# EasyEDA Pro project 16F.eprj

# Schematic DAQ_SCH

## Sheets
1 MCU: Board Name: DAQ_MB; Create Date: 2025-05-04; Page Name: MCU; Project Name: 16F; Schematic Name: DAQ_SCH; Update Date: 2025-05-22; Company: 嘉立创EDA; Page Size: A4; Version: V1.0
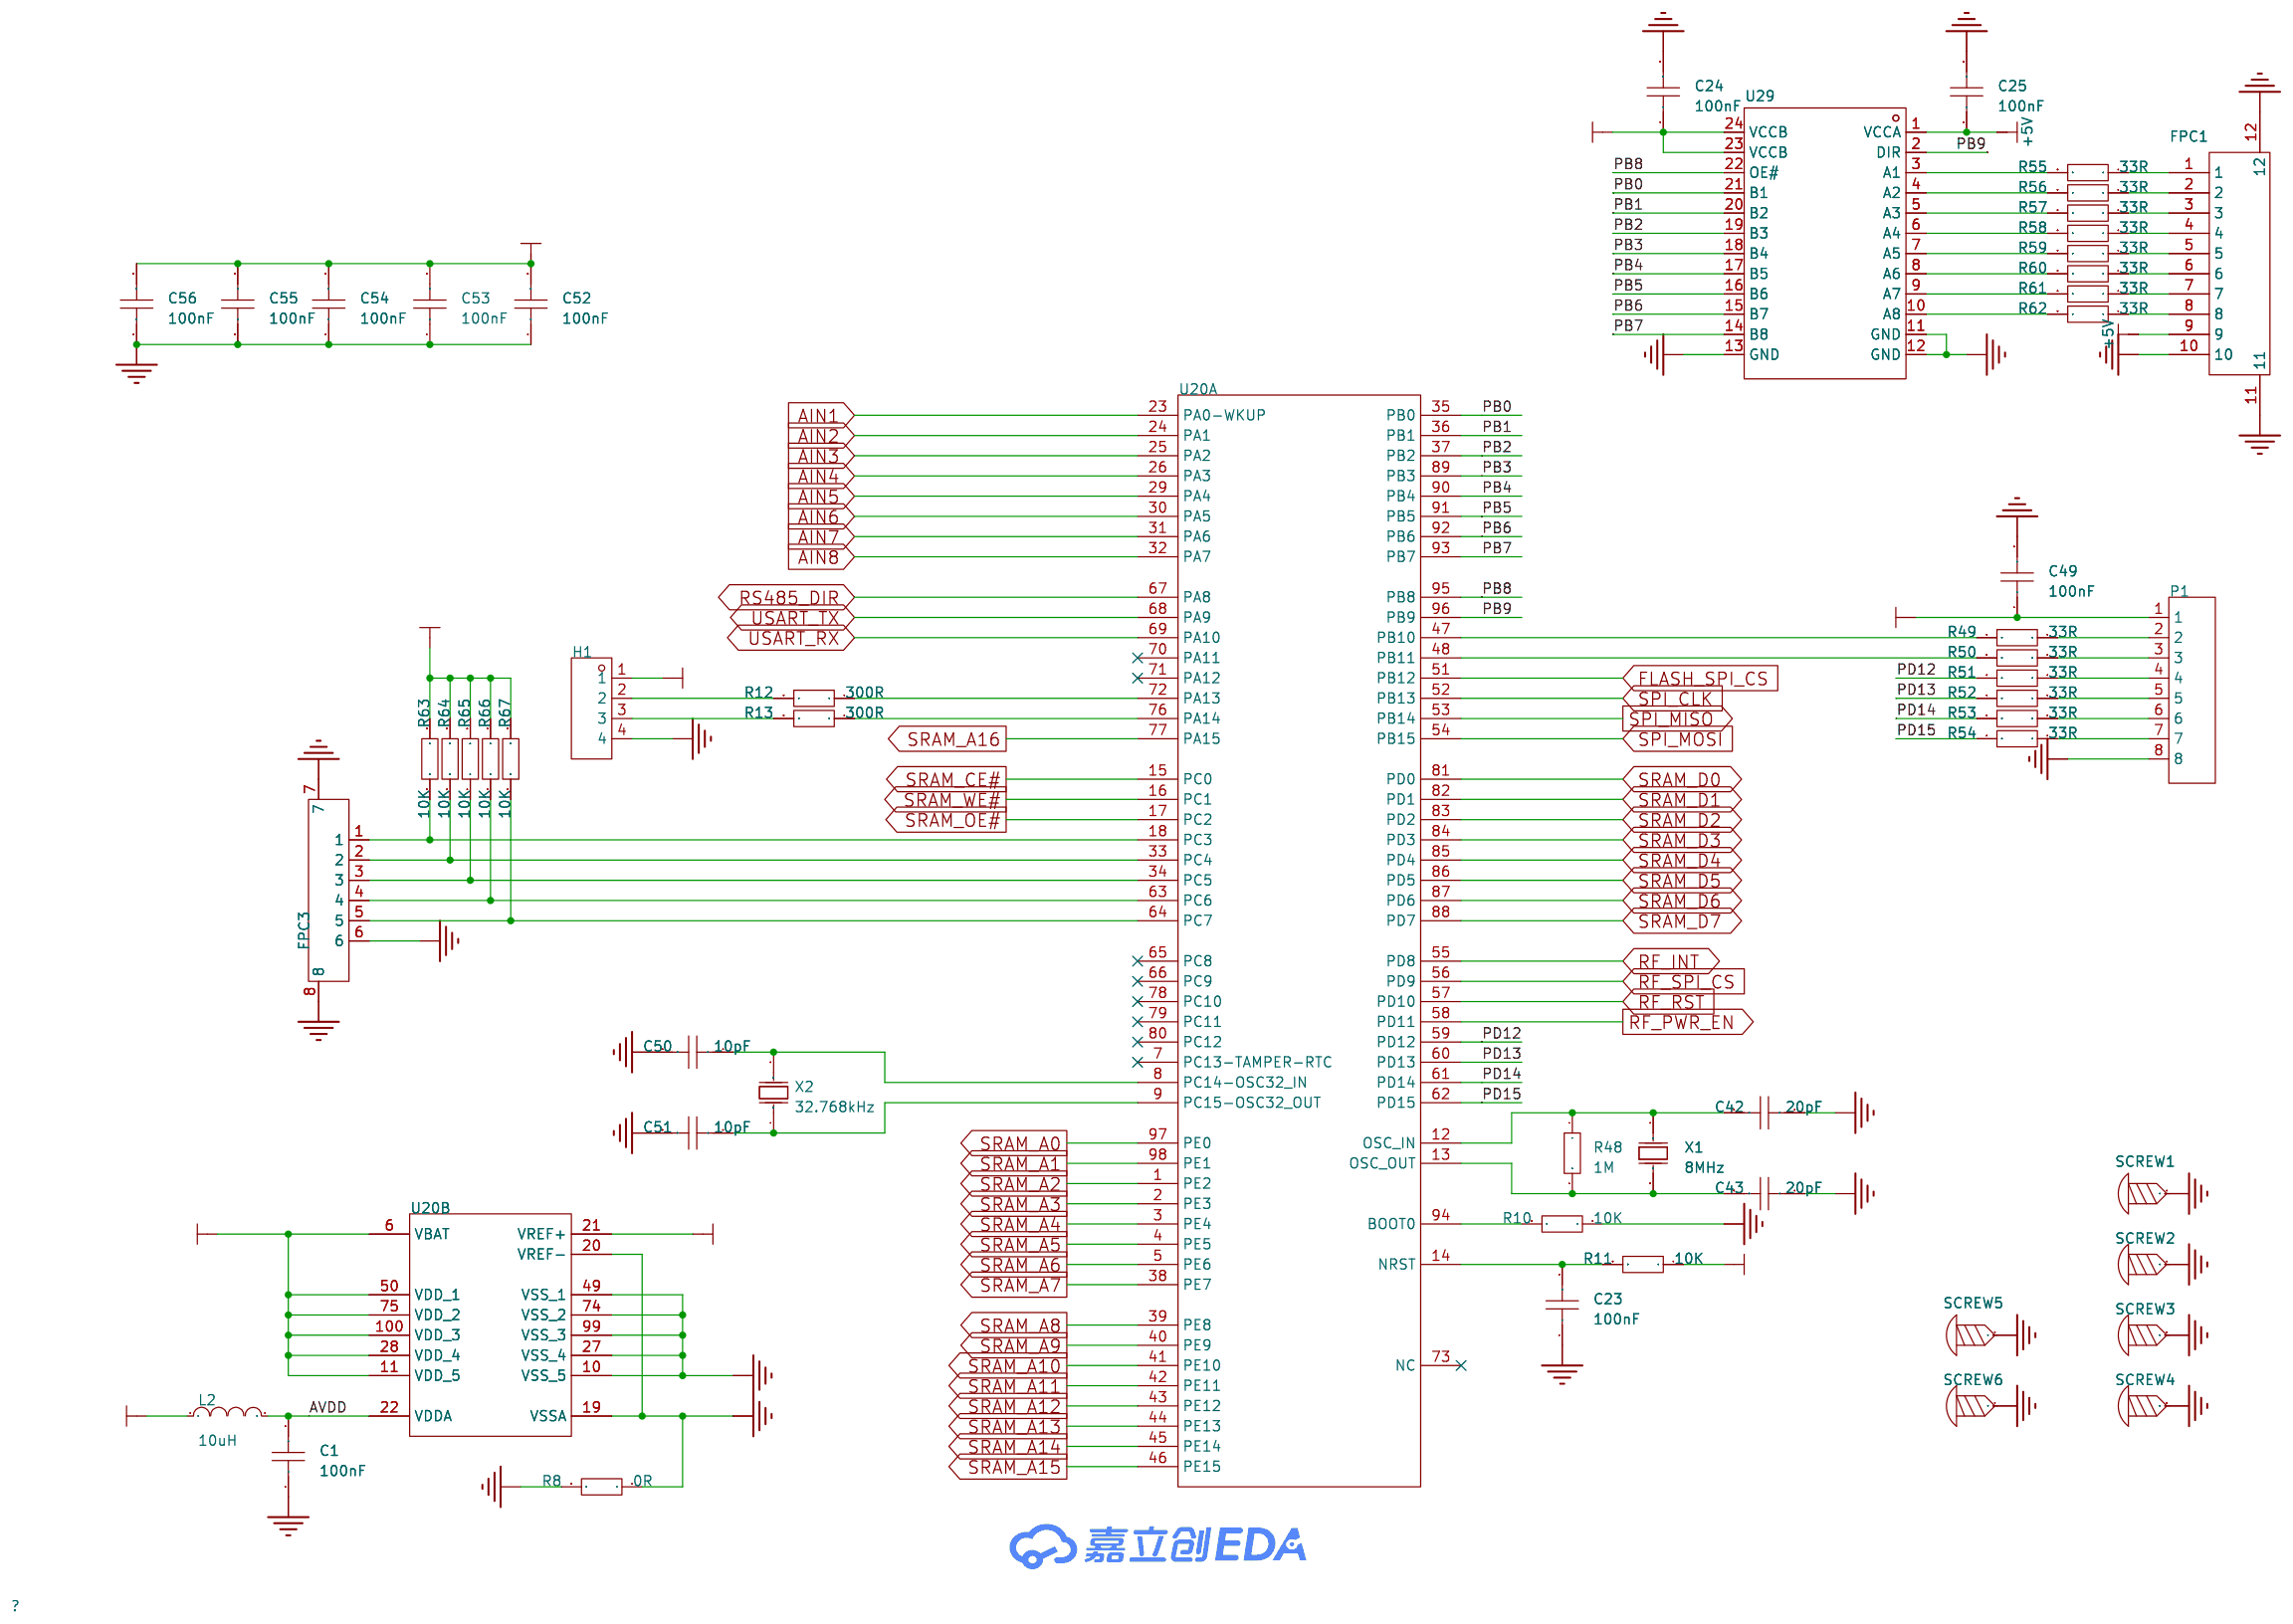
[diagram p0: MCU]
2 MEM: Page Name: MEM; Update Date: 2025-05-16
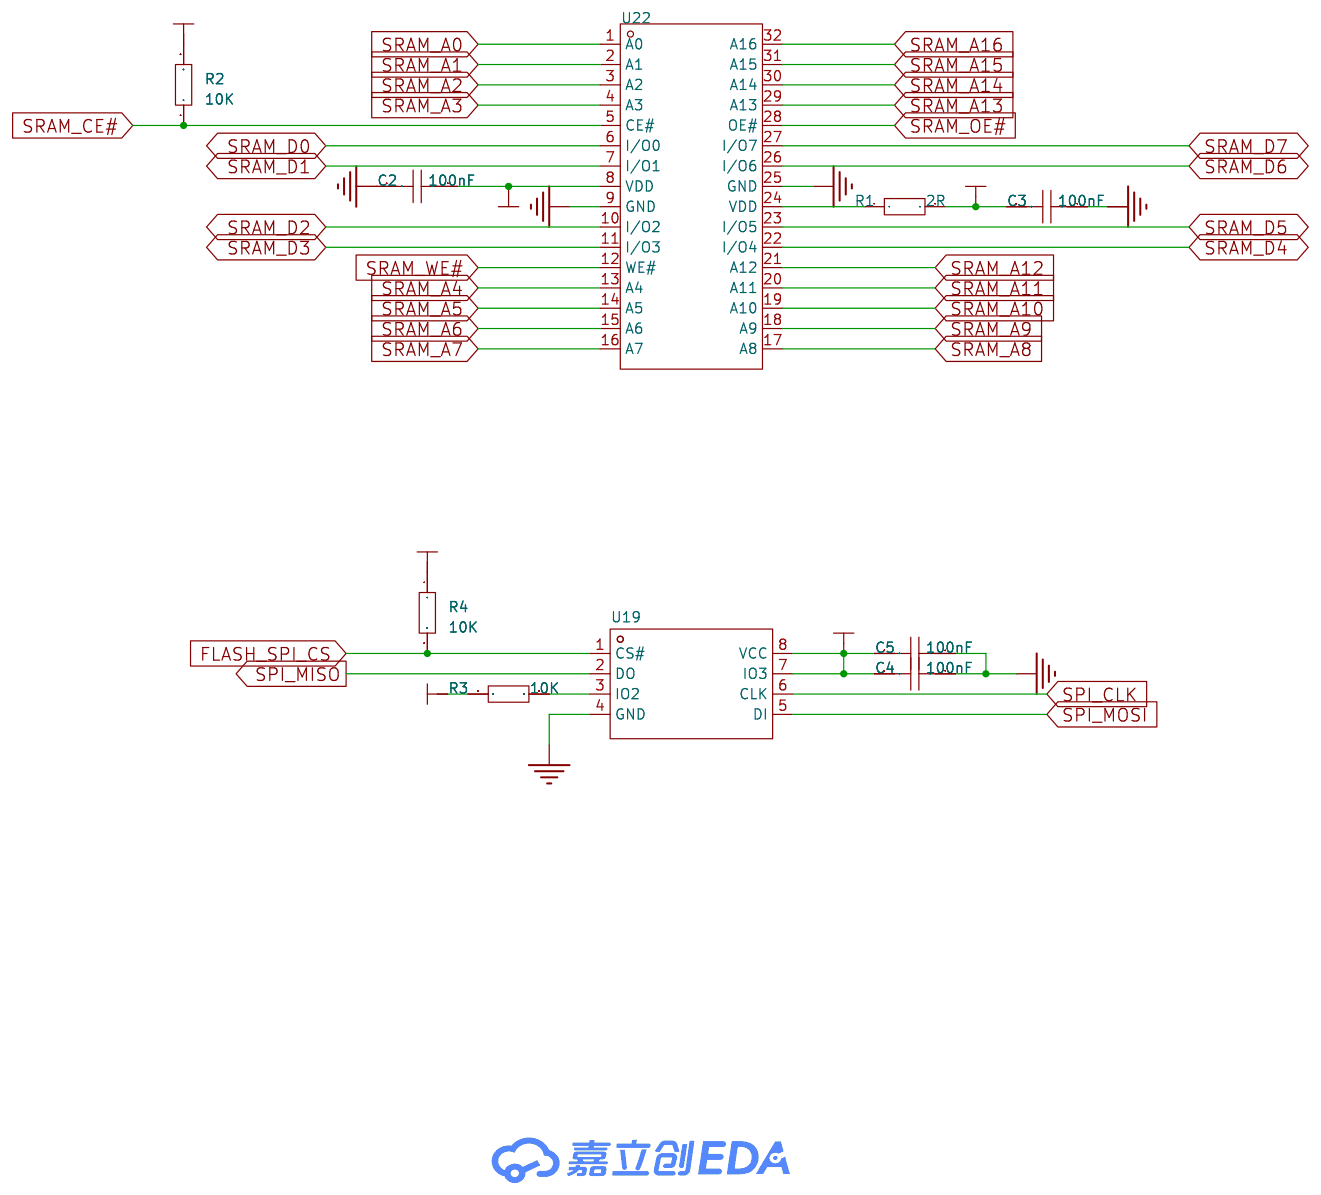
[diagram p1: MEM]
3 AIN: Page Name: AIN; Update Date: 2025-05-16
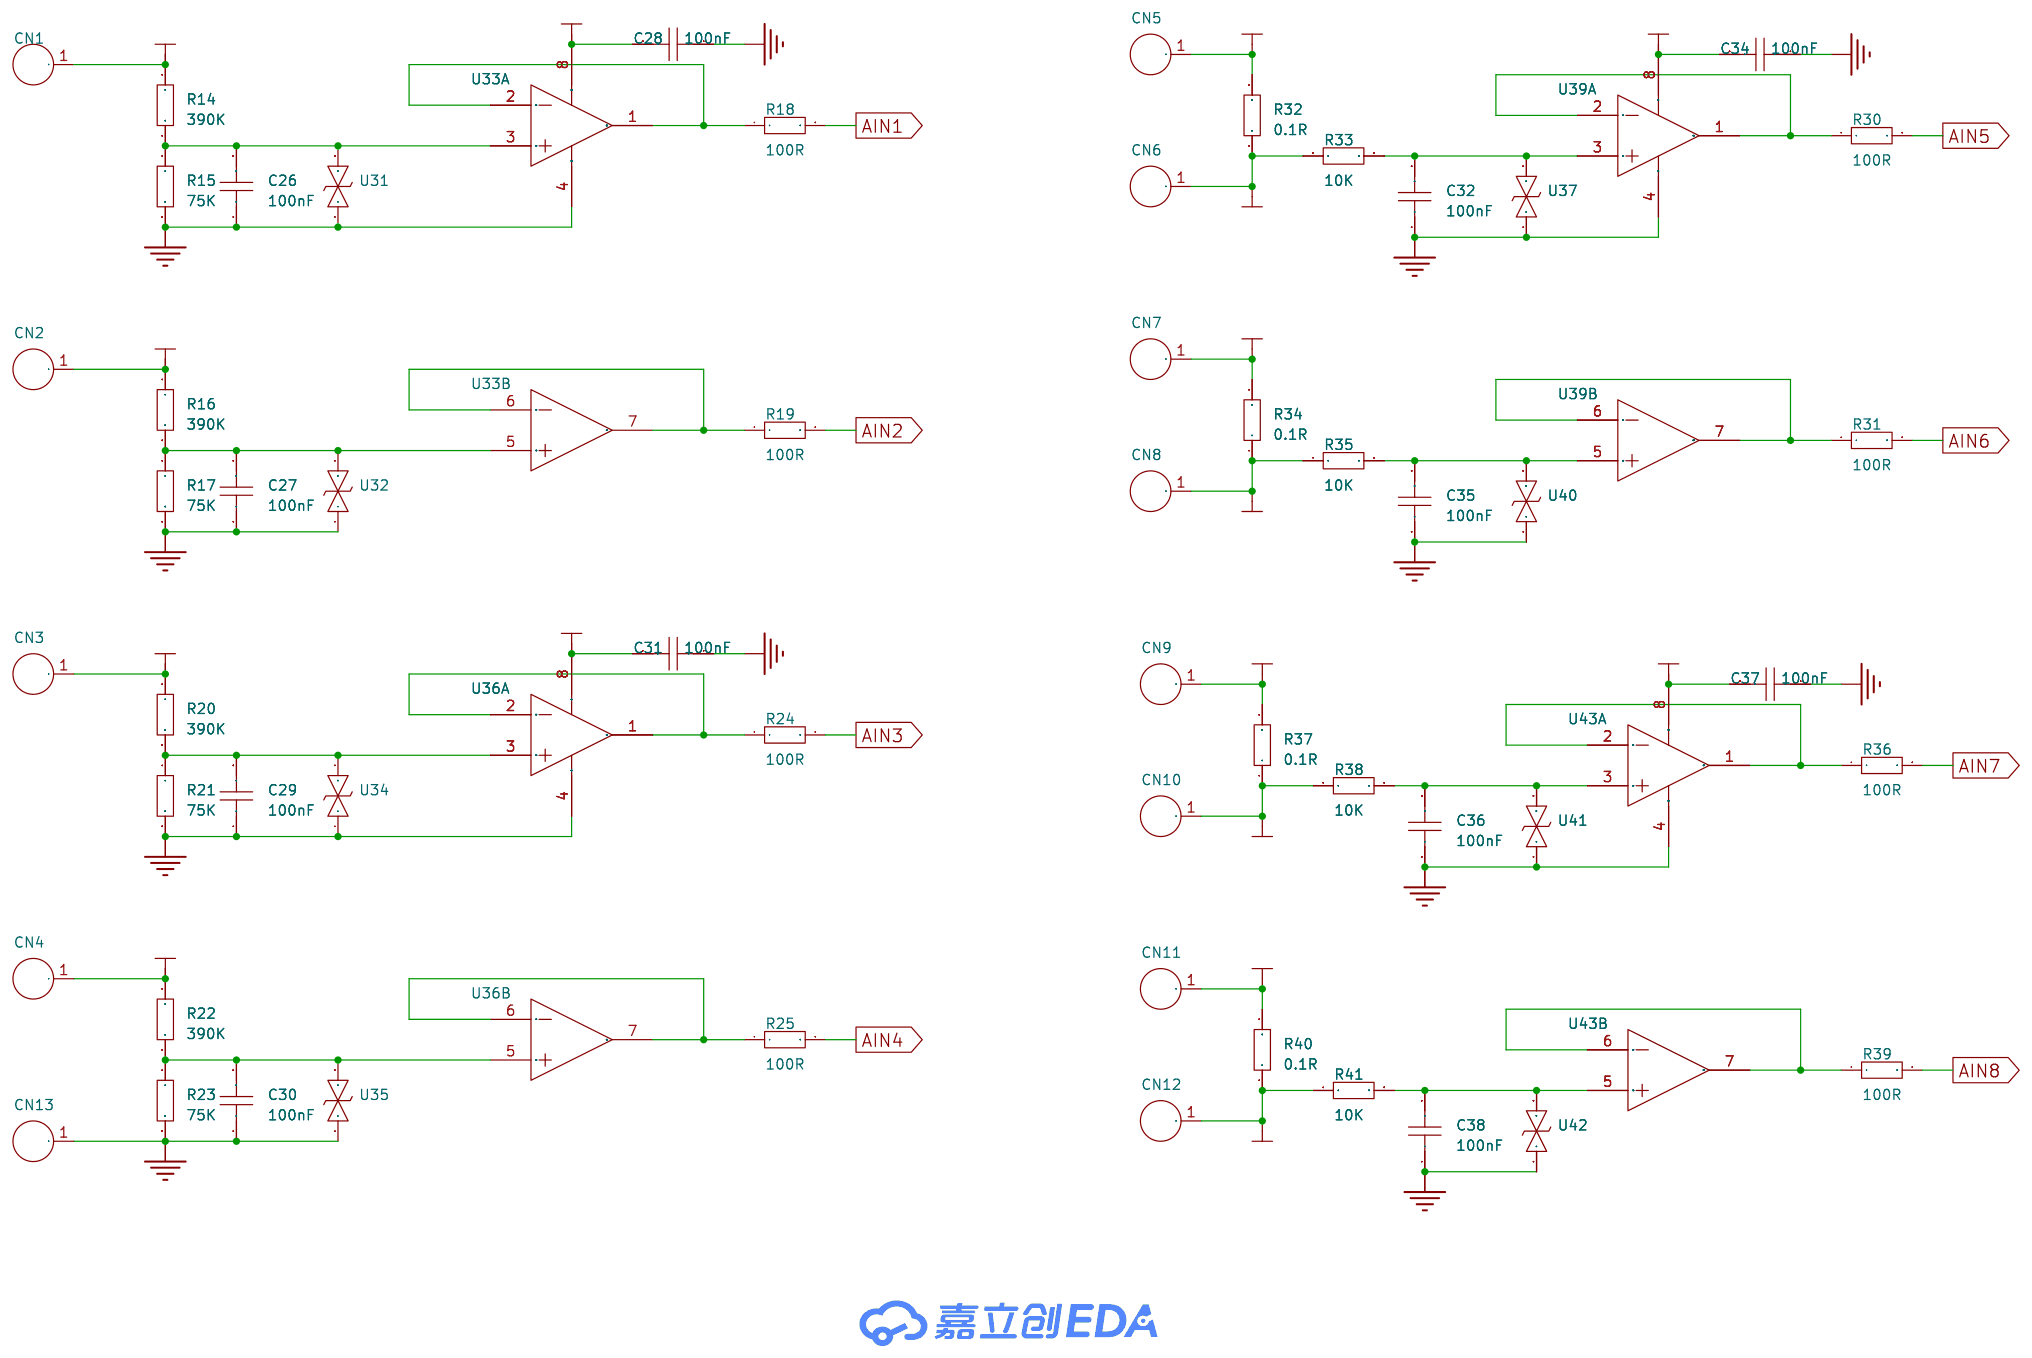
[diagram p2: AIN]
4 POWER: Page Name: POWER; Update Date: 2025-05-16
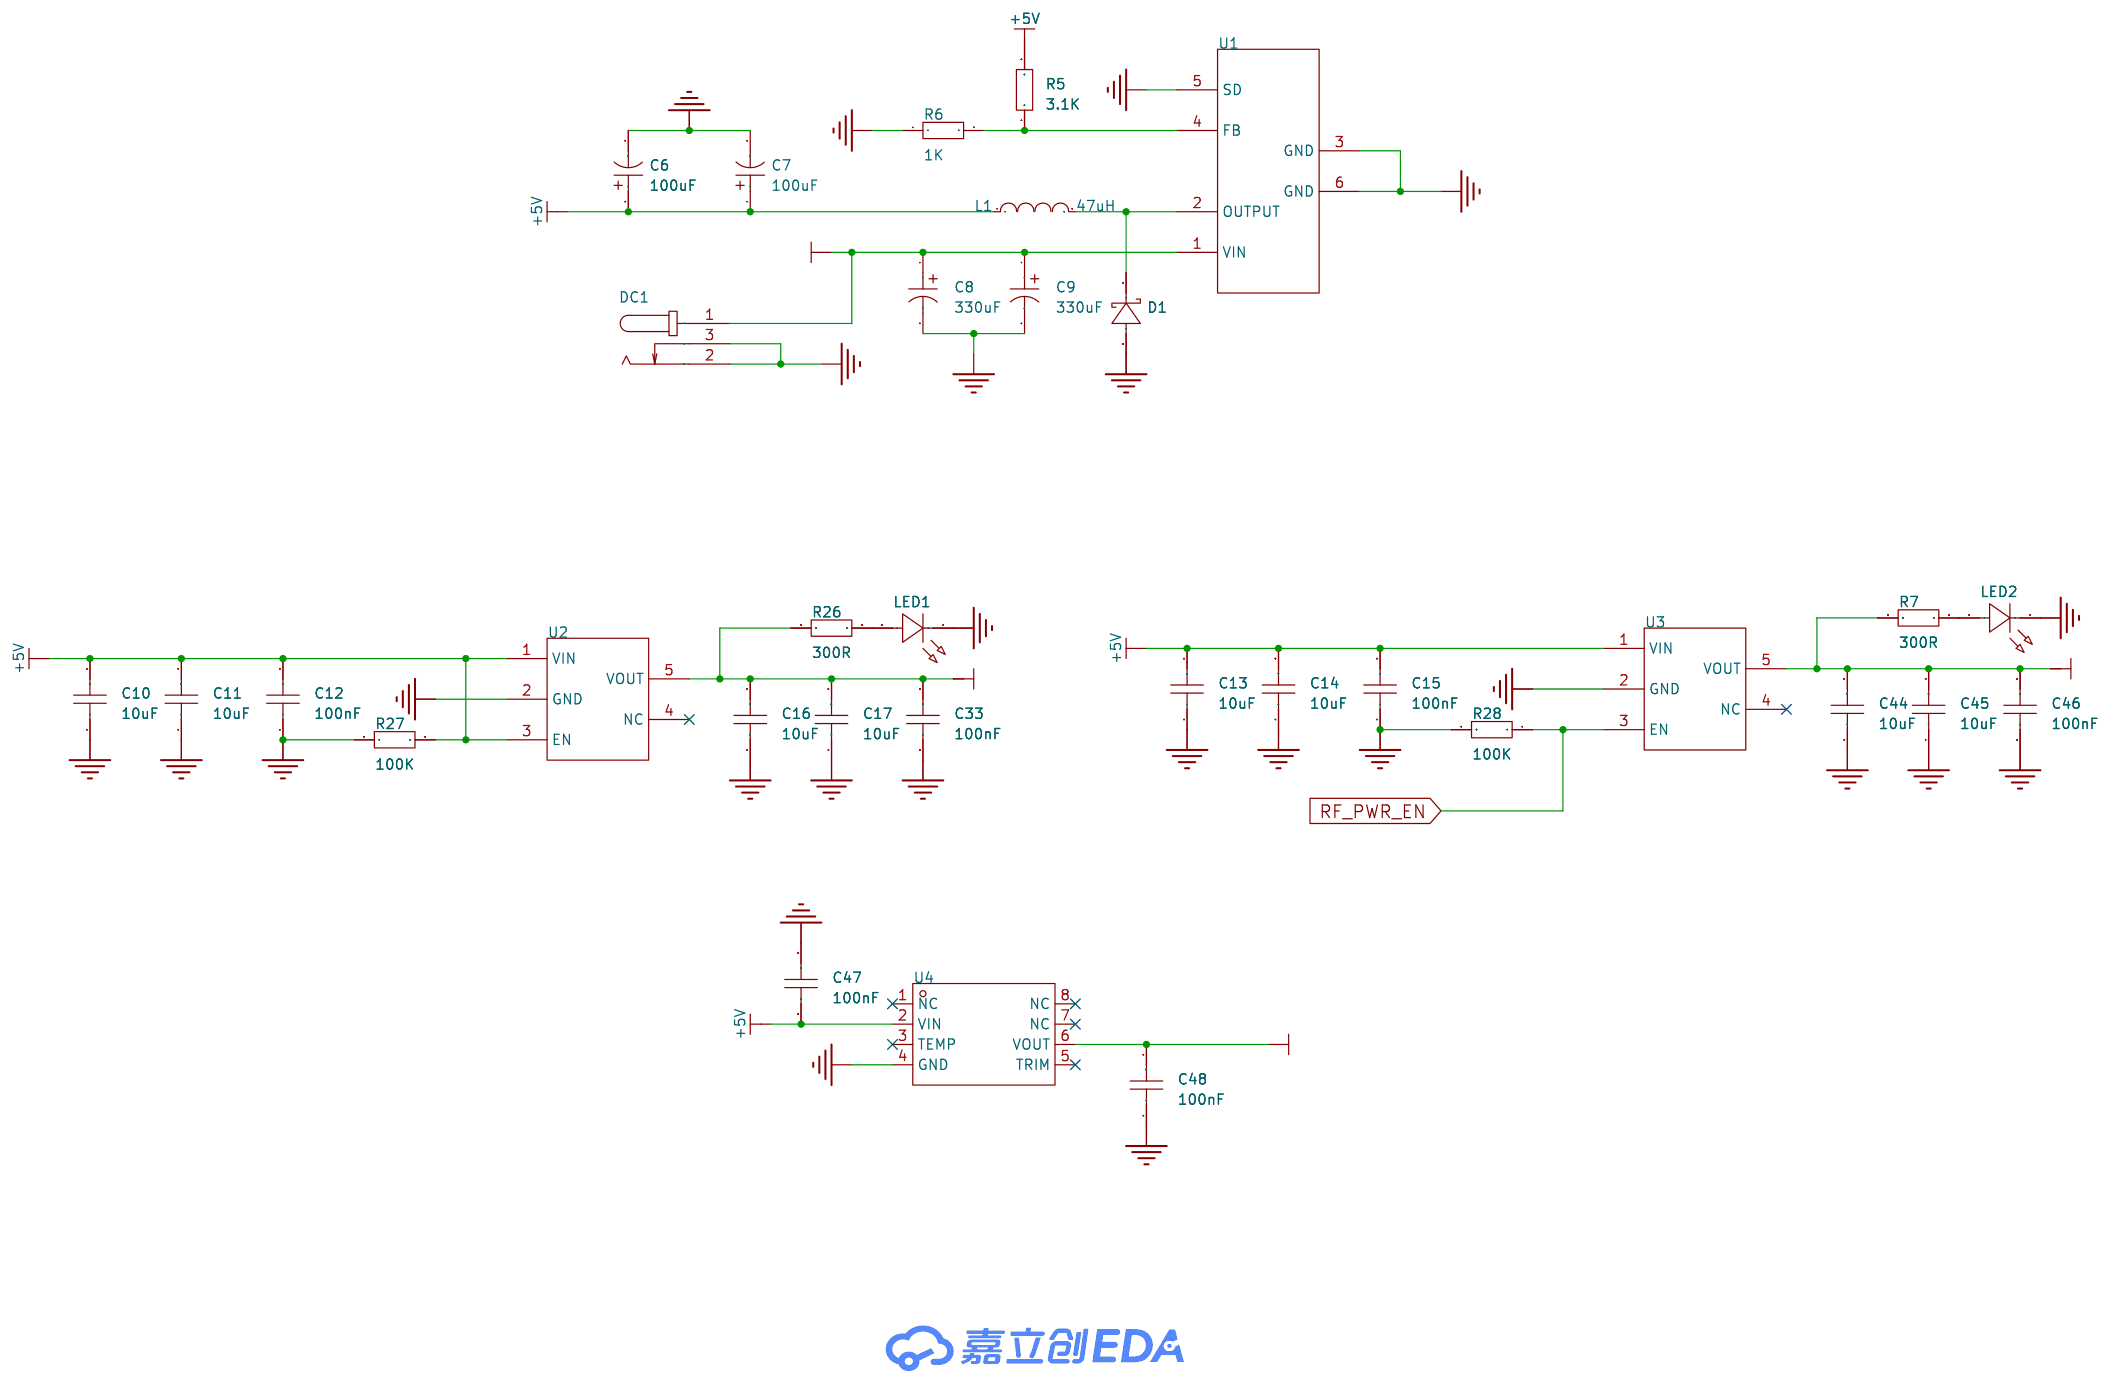
[diagram p3: POWER]
5 RF: Page Name: RF
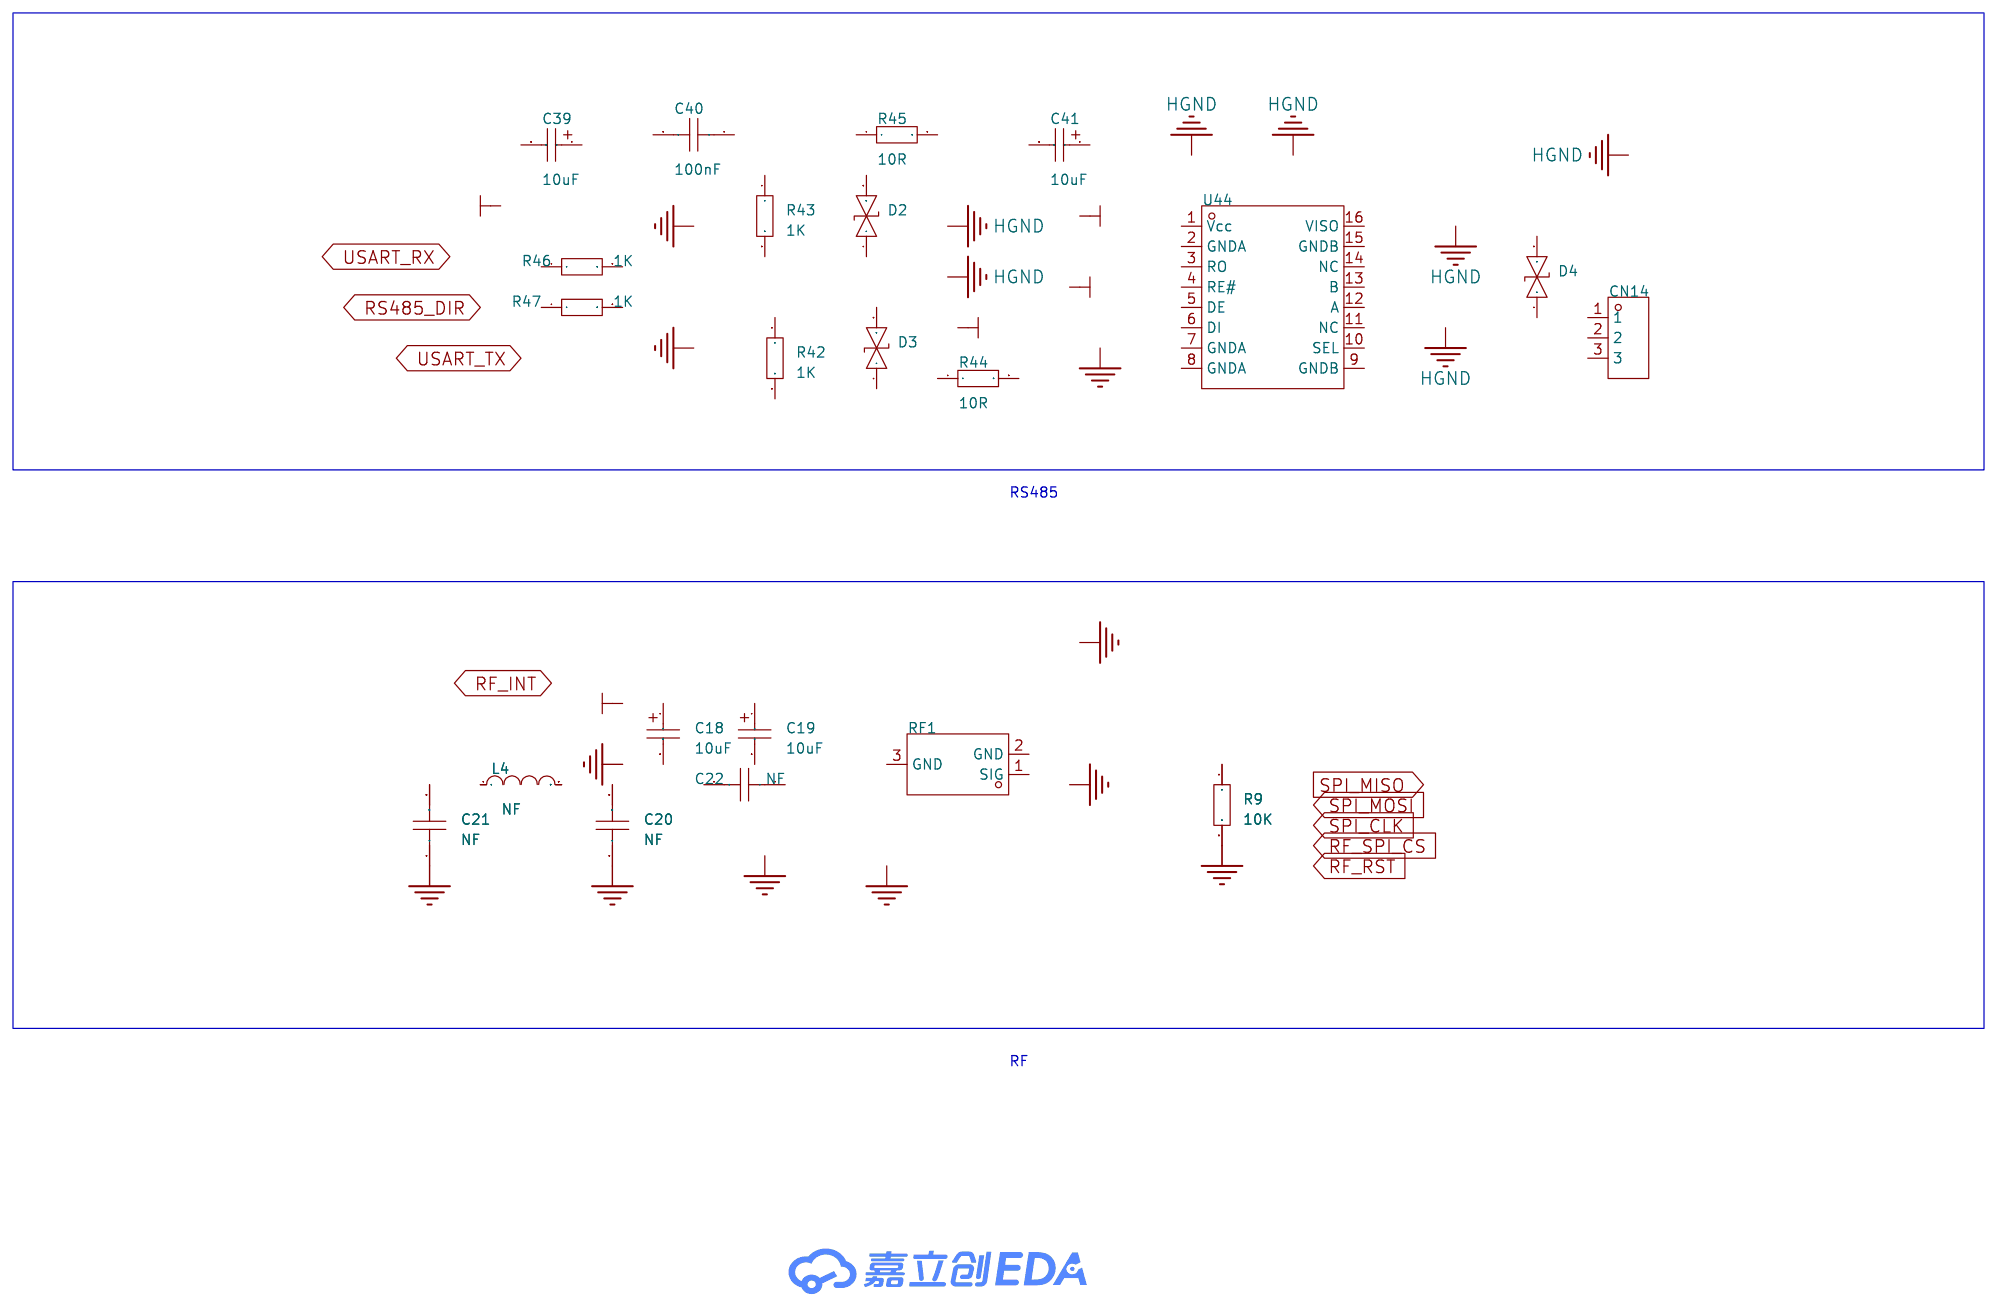
[diagram p4: RF]

## Parts
sheet AIN
C26  100nF  [C0805]
C27  100nF  [C0805]
C28  100nF  [C0805]
C29  100nF  [C0805]
C30  100nF  [C0805]
C31  100nF  [C0805]
C32  100nF  [C0805]
C34  100nF  [C0805]
C35  100nF  [C0805]
C36  100nF  [C0805]
C37  100nF  [C0805]
C38  100nF  [C0805]
CN1  8730  [CONN-TH_8730]
CN2  8730  [CONN-TH_8730]
CN3  8730  [CONN-TH_8730]
CN4  8730  [CONN-TH_8730]
CN5  8730  [CONN-TH_8730]
CN6  8730  [CONN-TH_8730]
CN7  8730  [CONN-TH_8730]
CN8  8730  [CONN-TH_8730]
CN9  8730  [CONN-TH_8730]
CN10  8730  [CONN-TH_8730]
CN11  8730  [CONN-TH_8730]
CN12  8730  [CONN-TH_8730]
CN13  8730  [CONN-TH_8730]
R14  390K  [R0805]
R15  75K  [R0805]
R16  390K  [R0805]
R17  75K  [R0805]
R18  100R  [R0805]
R19  100R  [R0805]
R20  390K  [R0805]
R21  75K  [R0805]
R22  390K  [R0805]
R23  75K  [R0805]
R24  100R  [R0805]
R25  100R  [R0805]
R30  100R  [R0805]
R31  100R  [R0805]
R32  0.1R  [R1210]
R33  10K  [R0805]
R34  0.1R  [R1210]
R35  10K  [R0805]
R36  100R  [R0805]
R37  0.1R  [R1210]
R38  10K  [R0805]
R39  100R  [R0805]
R40  0.1R  [R1210]
R41  10K  [R0805]
U31  BV-D505ZC-ES  [SOD-523_L1.2-W0.8-LS1.6-BI]
U32  BV-D505ZC-ES  [SOD-523_L1.2-W0.8-LS1.6-BI]
U33  LMV358IDR(UMW)  [SOP-8_L4.9-W3.9-P1.27-LS6.0-BL]  (sections 1,2)
U34  BV-D505ZC-ES  [SOD-523_L1.2-W0.8-LS1.6-BI]
U35  BV-D505ZC-ES  [SOD-523_L1.2-W0.8-LS1.6-BI]
U36  LMV358IDR(UMW)  [SOP-8_L4.9-W3.9-P1.27-LS6.0-BL]  (sections 1,2)
U37  BV-D505ZC-ES  [SOD-523_L1.2-W0.8-LS1.6-BI]
U39  LMV358IDR(UMW)  [SOP-8_L4.9-W3.9-P1.27-LS6.0-BL]  (sections 1,2)
U40  BV-D505ZC-ES  [SOD-523_L1.2-W0.8-LS1.6-BI]
U41  BV-D505ZC-ES  [SOD-523_L1.2-W0.8-LS1.6-BI]
U42  BV-D505ZC-ES  [SOD-523_L1.2-W0.8-LS1.6-BI]
U43  LMV358IDR(UMW)  [SOP-8_L4.9-W3.9-P1.27-LS6.0-BL]  (sections 1,2)
sheet MCU
C1  100nF  [C0805]
C23  100nF  [C0805]
C24  100nF  [C0805]
C25  100nF  [C0805]
C42  20pF  [C0805]
C43  20pF  [C0805]
C49  100nF  [C0805]
C50  10pF  [C0805]
C51  10pF  [C0805]
C52  100nF  [C0805]
C53  100nF  [C0805]
C54  100nF  [C0805]
C55  100nF  [C0805]
C56  100nF  [C0805]
FPC1  AFA07-S10FCA-00  [FPC-SMD_P1.00-10P_LCS-XJ-H2.0]
FPC3  FPC1.0-2H-WS-6P  [FPC-SMD_6P-P1.00_FPC1.0-2H-WS]
H1  -  [HDR-TH_4P-P2.54-V-F]
L2  10uH  [L0805]
P1  1.25T-8AW  [CONN-TH_8P-P1.25_1.25T-1-8AW]
R8  0R  [R0805]
R10  10K  [R0805]
R11  10K  [R0805]
R12  300R  [R0805]
R13  300R  [R0805]
R48  1M  [R0805]
R49  33R  [R0805]
R50  33R  [R0805]
R51  33R  [R0805]
R52  33R  [R0805]
R53  33R  [R0805]
R54  33R  [R0805]
R55  33R  [R0805]
R56  33R  [R0805]
R57  33R  [R0805]
R58  33R  [R0805]
R59  33R  [R0805]
R60  33R  [R0805]
R61  33R  [R0805]
R62  33R  [R0805]
R63  10K  [R0805]
R64  10K  [R0805]
R65  10K  [R0805]
R66  10K  [R0805]
R67  10K  [R0805]
SCREW1  -  [M2螺丝]
SCREW2  -  [M2螺丝]
SCREW3  -  [M2螺丝]
SCREW4  -  [M2螺丝]
SCREW5  -  [M3螺丝]
SCREW6  -  [M3螺丝]
U20  STM32F103VBT6  [LQFP-100_L14.0-W14.0-P0.50-LS16.0-BL]  (sections 1,2)
U29  SN74LVC8T245PWR  [TSSOP-24_L7.8-W4.4-P0.65-LS6.4-BL]
X1  8MHz  [CRYSTAL-SMD_L5.0-W3.2]
X2  32.768kHz  [OSC-SMD_L3.2-W1.5]
sheet MEM
C2  100nF  [C0805]
C3  100nF  [C0805]
C4  100nF  [C0805]
C5  100nF  [C0805]
R1  2R  [R0805]
R2  10K  [R0805]
R3  10K  [R0805]
R4  10K  [R0805]
U19  W25Q128JVSIQ  [SOIC-8_L5.3-W5.3-P1.27-LS8.0-BL]
U22  IS63WV1288DBLL-10TLI  [TSOPII-32_L21.0-W10.2-P1.27-LS11.8-BL]
sheet POWER
C6  100uF  [CAP-SMD_BD6.3-L6.6-W6.6-LS7.3-FD-H7.7]
C7  100uF  [CAP-SMD_BD6.3-L6.6-W6.6-LS7.3-FD-H7.7]
C8  330uF  [CAP-SMD_BD10.0-L10.3-W10.3-FD-LS11.0]
C9  330uF  [CAP-SMD_BD10.0-L10.3-W10.3-FD-LS11.0]
C10  10uF  [C0805]
C11  10uF  [C0805]
C12  100nF  [C0805]
C13  10uF  [C0805]
C14  10uF  [C0805]
C15  100nF  [C0805]
C16  10uF  [C0805]
C17  10uF  [C0805]
C33  100nF  [C0805]
C44  10uF  [C0805]
C45  10uF  [C0805]
C46  100nF  [C0805]
C47  100nF  [C0805]
C48  100nF  [C0805]
D1  SS34B  [SMB_L4.6-W3.5-LS5.3-RD]
DC1  DC-005-A200  [DC-IN-TH_DC-005-A200]
L1  47uH  [IND-SMD_L10.8-W10.0_SLO1040H]
LED1  XL-2012SURC  [LED0805-RD_RED]
LED2  XL-2012SURC  [LED0805-RD_RED]
R5  3.1K  [R0805]
R6  1K  [R0805]
R7  300R  [R0805]
R26  300R  [R0805]
R27  100K  [R0805]
R28  100K  [R0805]
U1  AP1501-50K5G-13  [TO-263-5_L10.2-W9.2-P1.70-LS15.2-TL]
U2  RT9013-33GB  [SOT-23-5_L3.0-W1.7-P0.95-LS2.8-BL]
U3  RT9013-33GB  [SOT-23-5_L3.0-W1.7-P0.95-LS2.8-BL]
U4  REF03GSZ-REEL7  [SOIC-8_L4.9-W3.9-P1.27-LS6.0-BL]
sheet RF
C18  10uF  [CAP-SMD_L3.2-W1.6-RD-C7171]
C19  10uF  [CAP-SMD_L3.2-W1.6-RD-C7171]
C20  NF  [C0805]
C21  NF  [C0805]
C22  NF  [C0805]
C39  10uF  [CAP-SMD_L3.2-W1.6-RD-C7171]
C40  100nF  [C0805]
C41  10uF  [CAP-SMD_L3.2-W1.6-RD-C7171]
CN14  DB128V-5.08-3P-GN-S  [CONN-TH_3P-P5.08_DIBO_DB128V-5.08-3P-X]
D2  SMAJ5.0CA  [SMA_L4.4-W2.6-LS5.0-BI]
D3  SMAJ5.0CA  [SMA_L4.4-W2.6-LS5.0-BI]
D4  SMAJ5.0CA  [SMA_L4.4-W2.6-LS5.0-BI]
L4  NF  [L0805]
R9  10K  [R0805]
R42  1K  [R0805]
R43  1K  [R0805]
R44  10R  [R0805]
R45  10R  [R0805]
R46  1K  [R0805]
R47  1K  [R0805]
RF1  BWIPX-1-001E  [IPEX-SMD_BWIPX-1-001E]
U44  CA-IS3092W  [SOIC-16_L10.3-W7.5-P1.27-LS10.3-BL]

## Library data of the parts
C1-C5 C10-C17 C20-C38 C40 C42-C56 = CAP_0805: Supplier Footprint: 0805
CN1-CN13 = 8730: Supplier Part: C7200700; Manufacturer: Keystone; Supplier Footprint: 插件; JLCPCB Part Class: 扩展库; Datasheet: https://atta.szlcsc.com/upload/public/pdf/source/20221117/B511184CD1D7BF94E7F8FBB689A0BE88.pdf; Supplier: LCSC
R1-R28 R30 R31 R33 R35 R36 R38 R39 R41-R67 = Res_0805: Supplier Footprint: 0805
R32 R34 R37 R40 = Res_1210: Supplier Footprint: 1210
U31 U32 U34 U35 U37 U40-U42 = BV-D505ZC-ES: 极性:双向;反向截止电压(Vrwm):5V;最大钳位电压:7V;峰值脉冲电流(Ipp):8A;峰值脉冲功率(Ppp):80W;击穿电压:5.8V;; LCSC Part Name: 普容5.0V，单路双向ESD静电防护器件，30kV，CJ：12pF；音频/视频/通讯防护; Supplier Part: C19170829; Manufacturer: ElecSuper(静芯微); Supplier Footprint: SOD523; JLCPCB Part Class: 扩展库; Datasheet: https://atta.szlcsc.com/upload/public/pdf/source/20240905/D713D2154168E21E11EA4EC40D6E74B3.pdf; Supplier: LCSC; polarity: 双向; Reverse Stand-Off Voltage (Vrwm): 5V; Maximum Clamping Voltage: 7V; Peak Pulse Current (Ipp): 8A; Peak Pulse Power Dissipation (Ppp): 80W; Breakdown Voltage: 5.8V; Reverse Leakage Current (Ir): 1uA; Number of Lines: 单路; Type: ESD
U33 U36 U39 U43 = LMV358IDR(UMW)_C3008587: 低功耗运放; LCSC Part Name: 低功耗运放; Supplier Part: C3008587; Manufacturer: UMW(友台半导体); Supplier Footprint: SOP-8; JLCPCB Part Class: 扩展库; Datasheet: https://atta.szlcsc.com/upload/public/pdf/source/20231221/3CE86AED7262DC01AD69B40B1A503791.pdf; Supplier: LCSC
FPC1 = AFA07-S10FCA-00: 锁定特性:抽屉式;触点类型:下接;触点数量:10P;间距:1mm;安装类型:卧贴;; LCSC Part Name: 间距:1mm P数:10P 抽屉式 下接; Supplier Part: C262716; Manufacturer: JS(钜硕电子); Supplier Footprint: SMD,P=1mm,卧贴; JLCPCB Part Class: 扩展库; Datasheet: https://atta.szlcsc.com/upload/public/pdf/source/20191217/C262716_30B15E9A77BFCA4A54741C92DB3BE8CC.pdf; Supplier: LCSC; Locking Feature: 抽屉式; Contact Type: 下接; Number of Contacts: 10P; Pitch: 1mm; Mounting Type: 卧贴; FFC, FCB Thickness: 0.3mm; Height Above Board: 2.5mm
FPC3 = FPC1.0-2H-WS-6P: Supplier Part: C9900016910; Supplier Footprint: FPC-SMD_6P; JLCPCB Part Class: 扩展库; Supplier: LCSC
H1 = HDR-F_2.54_1x4P: Supplier Part: C2718488; Supplier Footprint: 插件
L2 L4 = L_0805
P1 = 1.25T-8AW_C10838: 插针结构:1x8P;间距:1.25mm;安装方式:弯插;参考系列:PicoBlade(MX 1.25);总PIN数:8P;排数:1;每排PIN数:8;行距:-;额定电流:-;触头材质:-;触头镀层:-;工作温度:-;; LCSC Part Name: 1x8P 间距:1.25mm 弯插 系列:PicoBlade(MX 1.25); Supplier Part: C10838; Manufacturer: BOOMELE(博穆精密); Supplier Footprint: P=1.25mm; JLCPCB Part Class: 扩展库; Datasheet: https://atta.szlcsc.com/upload/public/pdf/source/20171230/C145982_15146280535401222069.pdf; Supplier: LCSC; Pins Structure: 1x8P; Pitch: 1.25mm; Mounting Type: 弯插; Reference Series: PicoBlade(MX 1.25); Number of Pins: 8P; Number of Rows: 1; Number of PINs Per Row: 8
SCREW1-SCREW4 = M2螺丝: Supplier Footprint: 插件
SCREW5 SCREW6 = M3螺丝: Supplier Footprint: 插件
U20 = STM32F103VBT6: CPU内核:ARM-M3;CPU最大主频:72MHz;应用领域:-;; LCSC Part Name: 主流增强型ARM Cortex-M3 MCU，具有128 KB Flash、72 MHz CPU、电机控制、USB和CAN; Supplier Part: C8314; Manufacturer: ST(意法半导体); Supplier Footprint: LQFP-100(14x14); JLCPCB Part Class: 扩展库; Datasheet: https://atta.szlcsc.com/upload/public/pdf/source/20150811/1457707344439.pdf; Supplier: LCSC; CPU Core: ARM-M3; CPU Maximum Speed: 72MHz; Program Storage Size: 128KB; Program Memory Type: FLASH; Number of I/O: 80; ADC (Bit): 12bit; Low Voltage Detection Threshold: 2V~3.6V
U29 = SN74LVC8T245PWR: 电路数:1;每个电路通道数:8;; Supplier Part: C27643; Manufacturer: TI(德州仪器); Supplier Footprint: TSSOP-24; JLCPCB Part Class: 扩展库; Datasheet: https://www.ti.com/cn/lit/gpn/sn74lvc8t245; Supplier: LCSC; Number of Circuits: 1; Channels per Circuit: 8; Output Type: 三态; Operating Temperature: -40℃~+85℃
X1 = X50328MSB2GI: 晶振类型:贴片晶振;频率:8MHz;常温频差:±10ppm;负载电容:20pF;频率稳定度:±20ppm;; LCSC Part Name: 8MHz ±10ppm 20pF; Supplier Part: C115962; Manufacturer: YXC(扬兴晶振); Supplier Footprint: SMD5032; JLCPCB Part Class: 基础库; Datasheet: https://atta.szlcsc.com/upload/public/pdf/source/20240329/44922B0AF7B60E58E9B66993B6077277.pdf; Supplier: LCSC; Type: 贴片晶振; Normal temperature Frequency Tolerance: ±10ppm; Load Capacitance: 20pF; Frequency Stability: ±20ppm; Operating Temperature: -40℃~+85℃
X2 = Q13FC1350000300: LCSC Part Name: 32.768kHz ±20ppm 9pF; Supplier Part: C99010; Manufacturer: EPSON(爱普生); Supplier Footprint: SMD3215-2P; JLCPCB Part Class: Extended Part; Datasheet: https://atta.szlcsc.com/upload/public/pdf/source/20180326/C99010_950C9FF3AB99F3CA38909049227BEFA9.pdf; Supplier: LCSC; Crystal Type: 贴片无源晶振; Frequency Tolerance: ±20ppm; Load Capacitance: 9pF; Equivalent Series Resistance (ESR): 70kΩ; Operating Temperature: -40℃~+85℃
U19 = W25Q128JVSIQ: 接口类型:SPI;存储容量:128Mbit;时钟频率(fc):133MHz;; LCSC Part Name: W25Q128JVSIQ 编带; Supplier Part: C97521; Manufacturer: WINBOND(华邦); Supplier Footprint: SOIC-8-208mil; JLCPCB Part Class: 基础库; Datasheet: https://atta.szlcsc.com/upload/public/pdf/source/20170316/1489627409956.pdf; Supplier: LCSC; Interface Type: SPI; Memory Size: 128Mbit; Clock Frequency (fc): 133MHz; Supply Voltage: 2.7V~3.6V; Page Programming Time (Tpp): 700us; Block Erase Time (tBE): 120ms@(32KB); Data Retention - TDR (Year): 20年; Operating Temperature: -40℃~+85℃
U22 = IS63WV1288DBLL-10TLI: LCSC Part Name: IS63WV1288DBLL 10TLI; Supplier Part: C1350838; Manufacturer: ISSI(美国芯成); Supplier Footprint: TSOPII-32-10.2mm; JLCPCB Part Class: 扩展库; Datasheet: https://atta.szlcsc.com/upload/public/pdf/source/20210703/3F1A511FEBA7CD453EF6429C7A4C2555.pdf; Supplier: LCSC
C6 C7 = JVJ50V100M6x8: 容值:100uF;精度:±20%;额定电压:50V;纹波电流:140mA@100Hz;; LCSC Part Name: 100uF ±20% 50V; Supplier Part: C46550415; Manufacturer: 捷而瑞; Supplier Footprint: SMD,D6.3xL7.7mm; JLCPCB Part Class: 扩展库; Datasheet: https://atta.szlcsc.com/upload/public/pdf/source/20250307/5A84A08C3F2F96A6D3F2CE3F7352019C.pdf; Supplier: LCSC; Tolerance: ±20%; Voltage Rating: 50V; Ripple Current: 140mA@100Hz; Diameter: 6.3mm; Height - Seated (Max): 7.7mm; Lifetime: 2000hrs@105℃; Operating Temperature: -55℃~+105℃
C8 C9 = JVJ50V330M10x10: 容值:330uF;精度:±20%;额定电压:50V;纹波电流:220mA@100Hz;; LCSC Part Name: 330uF ±20% 50V; Supplier Part: C46550419; Manufacturer: 捷而瑞; Supplier Footprint: SMD,D10xL10.5mm; JLCPCB Part Class: 扩展库; Datasheet: https://atta.szlcsc.com/upload/public/pdf/source/20250307/5A84A08C3F2F96A6D3F2CE3F7352019C.pdf; Supplier: LCSC; Tolerance: ±20%; Voltage Rating: 50V; Ripple Current: 220mA@100Hz; Diameter: 10mm; Height - Seated (Max): 10.5mm; Lifetime: 2000hrs@105℃; Operating Temperature: -55℃~+105℃
D1 = SS34B_C7420366: 二极管配置:独立式;正向压降(Vf):550mV@3.0A;直流反向耐压(Vr):40V;整流电流:3A;; LCSC Part Name: 电压:40V 电流:3A; Supplier Part: C7420366; Manufacturer: 宏嘉诚; Supplier Footprint: SMB; Datasheet: https://atta.szlcsc.com/upload/public/pdf/source/20250121/6ECF561C2C3BC4B2993ABD3B603F350E.pdf; Supplier: LCSC; Diode Configuration: 独立式; Voltage - Forward(Vf@If): 550mV@3.0A; Voltage - DC Reverse(Vr): 40V; Current - Rectified: 3A; Reverse Leakage Current (Ir): 200uA@40V
DC1 = DC-005-A200: 连接器类型:DC电源插座;安装方式:弯插;触点内径:2mm;触点外径:6.4mm;额定电流:3A;额定电压:30V;工作温度范围:-20℃~+70℃;; LCSC Part Name: DC电源插座 内径:2mm 外径:6.4mm; Supplier Part: C720557; Manufacturer: XUNPU(讯普); Supplier Footprint: 插件; JLCPCB Part Class: 扩展库; Datasheet: https://atta.szlcsc.com/upload/public/pdf/source/20200812/C720557_2286DFCD6C75B71AF905731F627ABF3A.pdf; Supplier: LCSC; Connector Type: DC电源插座; Mounting Style: 弯插; Inside Contact Diameter: 2mm; Outside Contact Diameter: 6.4mm; Current Rating (Max): 3A; Voltage Rating (Max): 30V; Operating Temperature Range: -20℃~+70℃
L1 = SLO1040H470MTT: 电感值:47uH;精度:±20%;额定电流:3A;; LCSC Part Name: 47uH ±20%; Supplier Part: C182153; Manufacturer: Sunltech(韩国顺磁); Supplier Footprint: SMD; JLCPCB Part Class: 扩展库; Datasheet: https://atta.szlcsc.com/upload/public/pdf/source/20201009/C207854_ACA4210DD273ACBB198904FC5A3A8806.pdf; Supplier: LCSC; Tolerance: ±20%; Rated Current: 3A; DC Resistance (DCR): 145mΩ
LED1 LED2 = XL-2012SURC: 发光颜色:红色;功率:55mW;正向电流:25mA;主波长:617nm~621nm;透镜颜色:无色透明透镜;色温:-;发光角度:120°;载带方式:正贴;工作温度:-30℃~+85℃;; Supplier Part: C965812; Manufacturer: XINGLIGHT(成兴光); Supplier Footprint: 0805; JLCPCB Part Class: 扩展库; Datasheet: https://atta.szlcsc.com/upload/public/pdf/source/20221102/49E1A0A365644091E6270AF1C5E0FE37.pdf; Supplier: LCSC; Emitted Color: 红色; Power Dissipation: 55mW; Forward Current: 25mA; Dominant Wavelength: 617nm~621nm; Peak Wavelength: 623nm; Lens Color: 无色透明透镜; Viewing Angle: 120°; Mounting Sytle: 正贴; Operating Temperature: -30℃~+85℃
U1 = AP1501-50K5G-13: 功能类型:降压型;输出类型:固定;输入电压:4.5V~40V;输出电压:5V;输出电流:3A;; LCSC Part Name: 150KHz, 3A PWM 降压 DC/DC 转换器; Supplier Part: C9980; Manufacturer: DIODES(美台); Supplier Footprint: TO-263-5; JLCPCB Part Class: 扩展库; Datasheet: https://atta.szlcsc.com/upload/public/pdf/source/20170228/1488267697390.pdf; Supplier: LCSC; Function: 降压型; Output Type: 固定; Input Voltage: 4.5V~40V; Output Voltage: 5V; Output Current: 3A; Switching Frequency: 150kHz; Operating Temperature: -20℃~+85℃; Synchronous Rectification: 否; Number of Outputs: 1; Topology: 降压式; Quiescent Current (Iq): 150uA; Switch tube (built-in/external): 内置
U2 U3 = RT9013-33GB: 输出类型:固定;最大输入电压:5.5V;输出电压:3.3V;输出电流:500mA;电源纹波抑制比(PSRR):50dB@(10kHz);输出极性:正极;; LCSC Part Name: 输入5.5V 输出3.3V 500mA; Supplier Part: C47773; Manufacturer: RICHTEK(立锜); Supplier Footprint: SOT-23-5; JLCPCB Part Class: 扩展库; Datasheet: https://atta.szlcsc.com/upload/public/pdf/source/20150504/1457707282459.pdf; Supplier: LCSC; Output Type: 固定; Maximum Input Voltage: 5.5V; Output Voltage: 3.3V; Output Current: 500mA; Power Supply Rejection Ratio (PSRR): 50dB@(10kHz); Dropout Voltage: 400mV@(500mA); standby current: 50uA; Feature: 低ESR；防静电保护；热保护(TSD)；过流保护(OCP)；带使能; Operating Temperature: -40℃~+85℃; Output Polarity: 正极; Number of Outputs: 1
U4 = REF03GSZ-REEL7: 输出类型:固定;输入电压:4.5V~33V;输出电压:2.5V;输出电流:10mA;精度:±0.6%;; LCSC Part Name: 高精度电压基准源REF01/REF02/REF03; Supplier Part: C495339; Manufacturer: ADI(亚德诺); Supplier Footprint: SOIC-8; JLCPCB Part Class: 扩展库; Datasheet: https://atta.szlcsc.com/upload/public/pdf/source/20190419/C386292_7EBF65DB50FFCF64DDAF03DA9C452290.pdf; Supplier: LCSC; Output Type: 固定; Input Voltage: 4.5V~33V; Output Voltage: 2.5V; Output Current: 10mA; Tolerance: ±0.6%; Temperature Coefficient: 50ppm/℃; Reference Type: 串联; Supply Current: 1.4mA; Operating Temperature: -40℃~+85℃@(Ta)
C18 C19 C39 C41 = TAJA106K016RNJ: 容值:10uF;精度:±10%;额定电压:16V;等效串联电阻(ESR):3Ω@100kHz;; LCSC Part Name: 10uF ±10% 16V; Supplier Part: C7171; Manufacturer: Kyocera AVX; Supplier Footprint: CASE-A-3216-18(mm); JLCPCB Part Class: 基础库; Supplier: LCSC; Tolerance: ±10%; Voltage Rating: 16V; Equivalent Series Resistance(ESR): 3Ω@100kHz; Operating Temperature: -55℃~+125℃
CN14 = DB128V-5.08-3P-GN-S: 结构:1x3P;间距:5.08mm;颜色:绿色;安装方式:直插;排数:1;每排PIN数:3;额定电流:16A;额定电压:300V;线规 - AWG:12~22;线规 - 平方毫米:2.5;工作温度:-40℃~+105℃;; LCSC Part Name: 1x3P 5.08mm 直插 排数:1 每排P数:3; Supplier Part: C2915640; Manufacturer: DORABO(地博电气); Supplier Footprint: 插件,P=5.08mm; JLCPCB Part Class: 扩展库; Datasheet: https://atta.szlcsc.com/upload/public/pdf/source/20230106/CC449C10514519CDCE20F1C37DBF2DAC.pdf; Supplier: LCSC; Number of Positions or Pins: 1x3P; Pitch: 5.08mm; Color: 绿色; Mounting Type: 直插; Number of Pins: 3P; Number of Rows: 1; Number of PINs Per Row: 3; Screw Specification: M2.5; Current Rating: 16A; Voltage Rating (Max): 300V; Wire Gauge - AWG: 12~22; Wire Gauge - mm2: 2.5; Operating Temperature: -40℃~+105℃
D2-D4 = SMAJ5.0CA_C83324: 反向截止电压(Vrwm):5V;最大钳位电压:9.2V;峰值脉冲电流(Ipp)@10/1000us:43.5A;峰值脉冲功率(Ppp)@10/1000us:400W;击穿电压:6.4V;; LCSC Part Name: 双向TVS 5V截止 43.48A峰值脉冲; Supplier Part: C83324; Manufacturer: Littelfuse(美国力特); Supplier Footprint: SMA(DO-214AC); JLCPCB Part Class: 扩展库; Datasheet: https://atta.szlcsc.com/upload/public/pdf/source/20190402/C374025_5ACE77BC72947DF13CF0CBC7F8B57228.pdf; Supplier: LCSC; Reverse Stand-Off Voltage (Vrwm): 5V; Maximum Clamping Voltage: 9.2V; Peak Pulse Current (Ipp)@10/1000us: 43.5A; Peak Pulse Power Dissipation (Ppp)@10/1000us: 400W; Breakdown Voltage: 6.4V; Type: TVS
RF1 = BWIPX-1-001E: 连接器类型:板端;接口类型:内针;端口数量:1;接口直径:-;接口长度/高度:-;频率-最大值:6GHz;射频系列:IPEX;阻抗:50Ω;样式:-;工作温度范围:-;; LCSC Part Name: IPEX 内针; Supplier Part: C496552; Manufacturer: BAT WIRELESS(蝙蝠无线); Supplier Footprint: SMD; JLCPCB Part Class: 扩展库; Datasheet: https://atta.szlcsc.com/upload/public/pdf/source/20201223/C496552_05E5A9956EAE1A8819C5051D085B1DED.pdf; Supplier: LCSC; Connector Type: 板端; Interface Type: 内针; Number of Ports: 1; Frequency-Max: 6GHz; RF Series: IPEX; Impedance: 50Ω
U44 = CA-IS3092W: 5000V耐压集成隔离电源的隔离RS-485/422，三合一隔离485; LCSC Part Name: CA-IS309X 内置 DC-DC 转换器的隔离式 RS-485/RS-422 收发器; Supplier Part: C2890051; Manufacturer: Chipanalog(川土微); Supplier Footprint: SOIC-16-300mil; JLCPCB Part Class: 扩展库; Datasheet: https://atta.szlcsc.com/upload/public/pdf/source/20220525/D30CBAC15AB9B8C9F6FA7E9F13DA05A0.pdf; Supplier: LCSC; Data Rate(Max): 500Kbps; Communication Mode: 半双工; Integrated Power Supply Voltage: 3.3V；5V; Integrated Power Output Voltage: 3.3V；5V; Isolation Voltage(Vrms): 5000; CMTI(kV/us): 150kV/us; Operating Temperature: -40℃~125℃; Rating: 工业级

## Nets
+5V: C6.1 C7.1 C10.2 C11.2 C12.2 C13.2 C14.2 C15.2 C25.1 C47.1 FPC1.9 L1.1 R5.2 R27.1 U2.1(VIN) U2.3(EN) U3.1(VIN) U4.2(VIN) U29.1(VCCA)
AGND: C1.1 C26.1 C27.1 C28.1 C29.1 C30.1 C31.1 C32.1 C34.1 C35.1 C36.1 C37.1 C38.1 C48.1 CN13.1 R8.1 R15.2 R17.2 R21.2 R23.2 U20.19(VSSA) U20.20(VREF-) U31.1 U32.1 U33.4(VSS) U34.1 U35.1 U36.4(VSS) U37.1 U39.4(VSS) U40.1 U41.1 U42.1 U43.4(VSS)
AVDD: C1.2 C28.2 C31.2 C34.2 C37.2 L2.2 U20.22(VDDA) U33.8(VDD) U36.8(VDD) U39.8(VDD) U43.8(VDD)
GND: C2.1 C3.1 C4.1 C5.1 C6.2 C7.2 C8.2 C9.2 C10.1 C11.1 C12.1 C13.1 C14.1 C15.1 C16.1 C17.1 C20.1 C21.1 C23.1 C24.2 C25.2 C33.1 C42.1 C43.1 C44.1 C45.1 C46.1 C47.2 C49.2 C50.2 C51.2 C52.1 C53.1 C54.1 C55.1 C56.1 D1.2(A) DC1.2 DC1.3 FPC1.10 FPC1.11 FPC1.12 FPC3.6 FPC3.7 FPC3.8 H1.4 LED1.1(K) LED2.1(K) P1.8 R6.1 R8.2 R9.2 R10.1 R27.2 R28.2 SCREW1.1 SCREW2.1 SCREW3.1 SCREW4.1 SCREW5.1 SCREW6.1 U1.3(GND) U1.5(SD) U1.6(GND) U2.2(GND) U3.2(GND) U4.4(GND) U19.4(GND) U20.10(VSS_5) U20.27(VSS_4) U20.49(VSS_1) U20.74(VSS_2) U20.99(VSS_3) U22.9(GND) U22.25(GND) U29.11(GND) U29.12(GND) U29.13(GND)
VDD: C2.2 C3.2 C4.2 C5.2 C16.2 C17.2 C24.1 C33.2 C49.1 C52.2 C53.2 C54.2 C55.2 C56.2 H1.1 L2.1 P1.1 R1.2 R2.2 R3.2 R4.1 R11.1 R26.2 R63.2 R64.2 R65.2 R66.2 R67.2 U2.5(VOUT) U19.7(IO3) U19.8(VCC) U20.6(VBAT) U20.11(VDD_5) U20.28(VDD_4) U20.50(VDD_1) U20.75(VDD_2) U20.100(VDD_3) U22.8(VDD) U29.23(VCCB) U29.24(VCCB)
VIN1+: CN1.1 R14.1
VIN2+: CN2.1 R16.1
VIN3+: CN3.1 R20.1
VIN4+: CN4.1 R22.1
AIN1: R18.2 U20.23(PA0-WKUP)
AIN2: R19.2 U20.24(PA1)
AIN3: R24.2 U20.25(PA2)
AIN4: R25.2 U20.26(PA3)
AIN5: R30.2 U20.29(PA4)
AIN6: R31.2 U20.30(PA5)
AIN7: R36.2 U20.31(PA6)
AIN8: R39.2 U20.32(PA7)
DC: C8.1 C9.1 DC1.1 U1.1(VIN)
FLASH_SPI_CS: R4.2 U19.1(CS#) U20.51(PB12)
I1+: CN5.1 R32.2
I1-: CN6.1 R32.1 R33.1
I2+: CN7.1 R34.2
I2-: CN8.1 R34.1 R35.1
I3+: CN9.1 R37.2
I3-: CN10.1 R37.1 R38.1
I4+: CN11.1 R40.2
I4-: CN12.1 R40.1 R41.1
PB0: U20.35(PB0) U29.21(B1)
PB1: U20.36(PB1) U29.20(B2)
PB2: U20.37(PB2) U29.19(B3)
PB3: U20.89(PB3) U29.18(B4)
PB4: U20.90(PB4) U29.17(B5)
PB5: U20.91(PB5) U29.16(B6)
PB6: U20.92(PB6) U29.15(B7)
PB7: U20.93(PB7) U29.14(B8)
PB8: U20.95(PB8) U29.22(OE#)
PB9: U20.96(PB9) U29.2(DIR)
PD12: R51.2 U20.59(PD12)
PD13: R52.2 U20.60(PD13)
PD14: R53.2 U20.61(PD14)
PD15: R54.2 U20.62(PD15)
RF_INT: U20.55(PD8)
RF_PWR_EN: R28.1 U3.3(EN) U20.58(PD11)
RF_RST: U20.57(PD10)
RF_SPI_CS: U20.56(PD9)
RF_VDD: C44.2 C45.2 C46.2 R7.2 U3.5(VOUT)
RS485_DIR: U20.67(PA8)
SPI_CLK: U19.6(CLK) U20.52(PB13)
SPI_MISO: U19.2(DO) U20.53(PB14)
SPI_MOSI: U19.5(DI) U20.54(PB15)
SRAM_A0: U20.97(PE0) U22.1(A0)
SRAM_A1: U20.98(PE1) U22.2(A1)
SRAM_A2: U20.1(PE2) U22.3(A2)
SRAM_A3: U20.2(PE3) U22.4(A3)
SRAM_A4: U20.3(PE4) U22.13(A4)
SRAM_A5: U20.4(PE5) U22.14(A5)
SRAM_A6: U20.5(PE6) U22.15(A6)
SRAM_A7: U20.38(PE7) U22.16(A7)
SRAM_A8: U20.39(PE8) U22.17(A8)
SRAM_A9: U20.40(PE9) U22.18(A9)
SRAM_A10: U20.41(PE10) U22.19(A10)
SRAM_A11: U20.42(PE11) U22.20(A11)
SRAM_A12: U20.43(PE12) U22.21(A12)
SRAM_A13: U20.44(PE13) U22.29(A13)
SRAM_A14: U20.45(PE14) U22.30(A14)
SRAM_A15: U20.46(PE15) U22.31(A15)
SRAM_A16: U20.77(PA15) U22.32(A16)
SRAM_CE#: R2.1 U20.15(PC0) U22.5(CE#)
SRAM_D0: U20.81(PD0) U22.6(I/O0)
SRAM_D1: U20.82(PD1) U22.7(I/O1)
SRAM_D2: U20.83(PD2) U22.10(I/O2)
SRAM_D3: U20.84(PD3) U22.11(I/O3)
SRAM_D4: U20.85(PD4) U22.22(I/O4)
SRAM_D5: U20.86(PD5) U22.23(I/O5)
SRAM_D6: U20.87(PD6) U22.26(I/O6)
SRAM_D7: U20.88(PD7) U22.27(I/O7)
SRAM_OE#: U20.17(PC2) U22.28(OE#)
SRAM_WE#: U20.16(PC1) U22.12(WE#)
USART_RX: U20.69(PA10)
USART_TX: U20.68(PA9)
VREF: C48.2 U4.6(VOUT) U20.21(VREF+)
Net-(C23-2): C23.2 R11.2 U20.14(NRST)
Net-(C26-2): C26.2 R14.2 R15.1 U31.2 U33.3(IN A+)
Net-(C27-2): C27.2 R16.2 R17.1 U32.2 U33.5(IN B+)
Net-(C29-2): C29.2 R20.2 R21.1 U34.2 U36.3(IN A+)
Net-(C30-2): C30.2 R22.2 R23.1 U35.2 U36.5(IN B+)
Net-(C32-2): C32.2 R33.2 U37.2 U39.3(IN A+)
Net-(C35-2): C35.2 R35.2 U39.5(IN B+) U40.2
Net-(C36-2): C36.2 R38.2 U41.2 U43.3(IN A+)
Net-(C38-2): C38.2 R41.2 U42.2 U43.5(IN B+)
Net-(C42-2): C42.2 R48.1 U20.12(OSC_IN) X1.1(OSC1)
Net-(C43-2): C43.2 R48.2 U20.13(OSC_OUT) X1.2(OSC2)
Net-(C50-1): C50.1 U20.8(PC14-OSC32_IN) X2.2(OSC2)
Net-(C51-1): C51.1 U20.9(PC15-OSC32_OUT) X2.1(OSC1)
Net-(D1-1): D1.1(K) L1.2 U1.2(OUTPUT)
Net-(FPC1-1): FPC1.1 R55.1
Net-(FPC1-2): FPC1.2 R56.1
Net-(FPC1-3): FPC1.3 R57.1
Net-(FPC1-4): FPC1.4 R58.1
Net-(FPC1-5): FPC1.5 R59.1
Net-(FPC1-6): FPC1.6 R60.1
Net-(FPC1-7): FPC1.7 R61.1
Net-(FPC1-8): FPC1.8 R62.1
Net-(FPC3-1): FPC3.1 R63.1 U20.18(PC3)
Net-(FPC3-2): FPC3.2 R64.1 U20.33(PC4)
Net-(FPC3-3): FPC3.3 R65.1 U20.34(PC5)
Net-(FPC3-4): FPC3.4 R66.1 U20.63(PC6)
Net-(FPC3-5): FPC3.5 R67.1 U20.64(PC7)
Net-(H1-2): H1.2 R12.2
Net-(H1-3): H1.3 R13.2
Net-(LED1-2): LED1.2(A) R26.1
Net-(LED2-2): LED2.2(A) R7.1
Net-(P1-2): P1.2 R49.1
Net-(P1-3): P1.3 R50.1
Net-(P1-4): P1.4 R51.1
Net-(P1-5): P1.5 R52.1
Net-(P1-6): P1.6 R53.1
Net-(P1-7): P1.7 R54.1
Net-(R1-1): R1.1 U22.24(VDD)
Net-(R3-1): R3.1 U19.3(IO2)
Net-(R5-1): R5.1 R6.2 U1.4(FB)
Net-(R10-2): R10.2 U20.94(BOOT0)
Net-(R12-1): R12.1 U20.72(PA13)
Net-(R13-1): R13.1 U20.76(PA14)
Net-(R18-1): R18.1 U33.1(OUT A) U33.2(IN A-)
Net-(R19-1): R19.1 U33.6(IN B-) U33.7(OUT B)
Net-(R24-1): R24.1 U36.1(OUT A) U36.2(IN A-)
Net-(R25-1): R25.1 U36.6(IN B-) U36.7(OUT B)
Net-(R30-1): R30.1 U39.1(OUT A) U39.2(IN A-)
Net-(R31-1): R31.1 U39.6(IN B-) U39.7(OUT B)
Net-(R36-1): R36.1 U43.1(OUT A) U43.2(IN A-)
Net-(R39-1): R39.1 U43.6(IN B-) U43.7(OUT B)
Net-(R49-2): R49.2 U20.47(PB10)
Net-(R50-2): R50.2 U20.48(PB11)
Net-(R55-2): R55.2 U29.3(A1)
Net-(R56-2): R56.2 U29.4(A2)
Net-(R57-2): R57.2 U29.5(A3)
Net-(R58-2): R58.2 U29.6(A4)
Net-(R59-2): R59.2 U29.7(A5)
Net-(R60-2): R60.2 U29.8(A6)
Net-(R61-2): R61.2 U29.9(A7)
Net-(R62-2): R62.2 U29.10(A8)

Not connected (* = marked no-connect by the designer): C18 1 2; C19 1 2; C20 2; C21 2; C22 1 2; C39 1 2; C40 1 2; C41 1 2; CN14 1 2 3; D2 1 2; D3 1 2; D4 1 2; L4 1 2; R9 1; R42 1 2; R43 1 2; R44 1 2; R45 1 2; R46 1 2; R47 1 2; RF1 1(SIG) 2(GND) 3(GND); U2 4(NC)*; U3 4(NC)*; U4 1(NC)* 3(TEMP)* 5(TRIM)* 7(NC)* 8(NC)*; U20 7(PC13-TAMPER-RTC)* 65(PC8)* 66(PC9)* 70(PA11)* 71(PA12)* 73(NC)* 78(PC10)* 79(PC11)* 80(PC12)*; U44 1(Vcc) 2(GNDA) 3(RO) 4(RE#) 5(DE) 6(DI) 7(GNDA) 8(GNDA) 9(GNDB) 10(SEL) 11(NC) 12(A) 13(B) 14(NC) 15(GNDB) 16(VISO)

## Notes on the sheets
sheet 5
- RS485
- RF

# Board DAQ_PCB
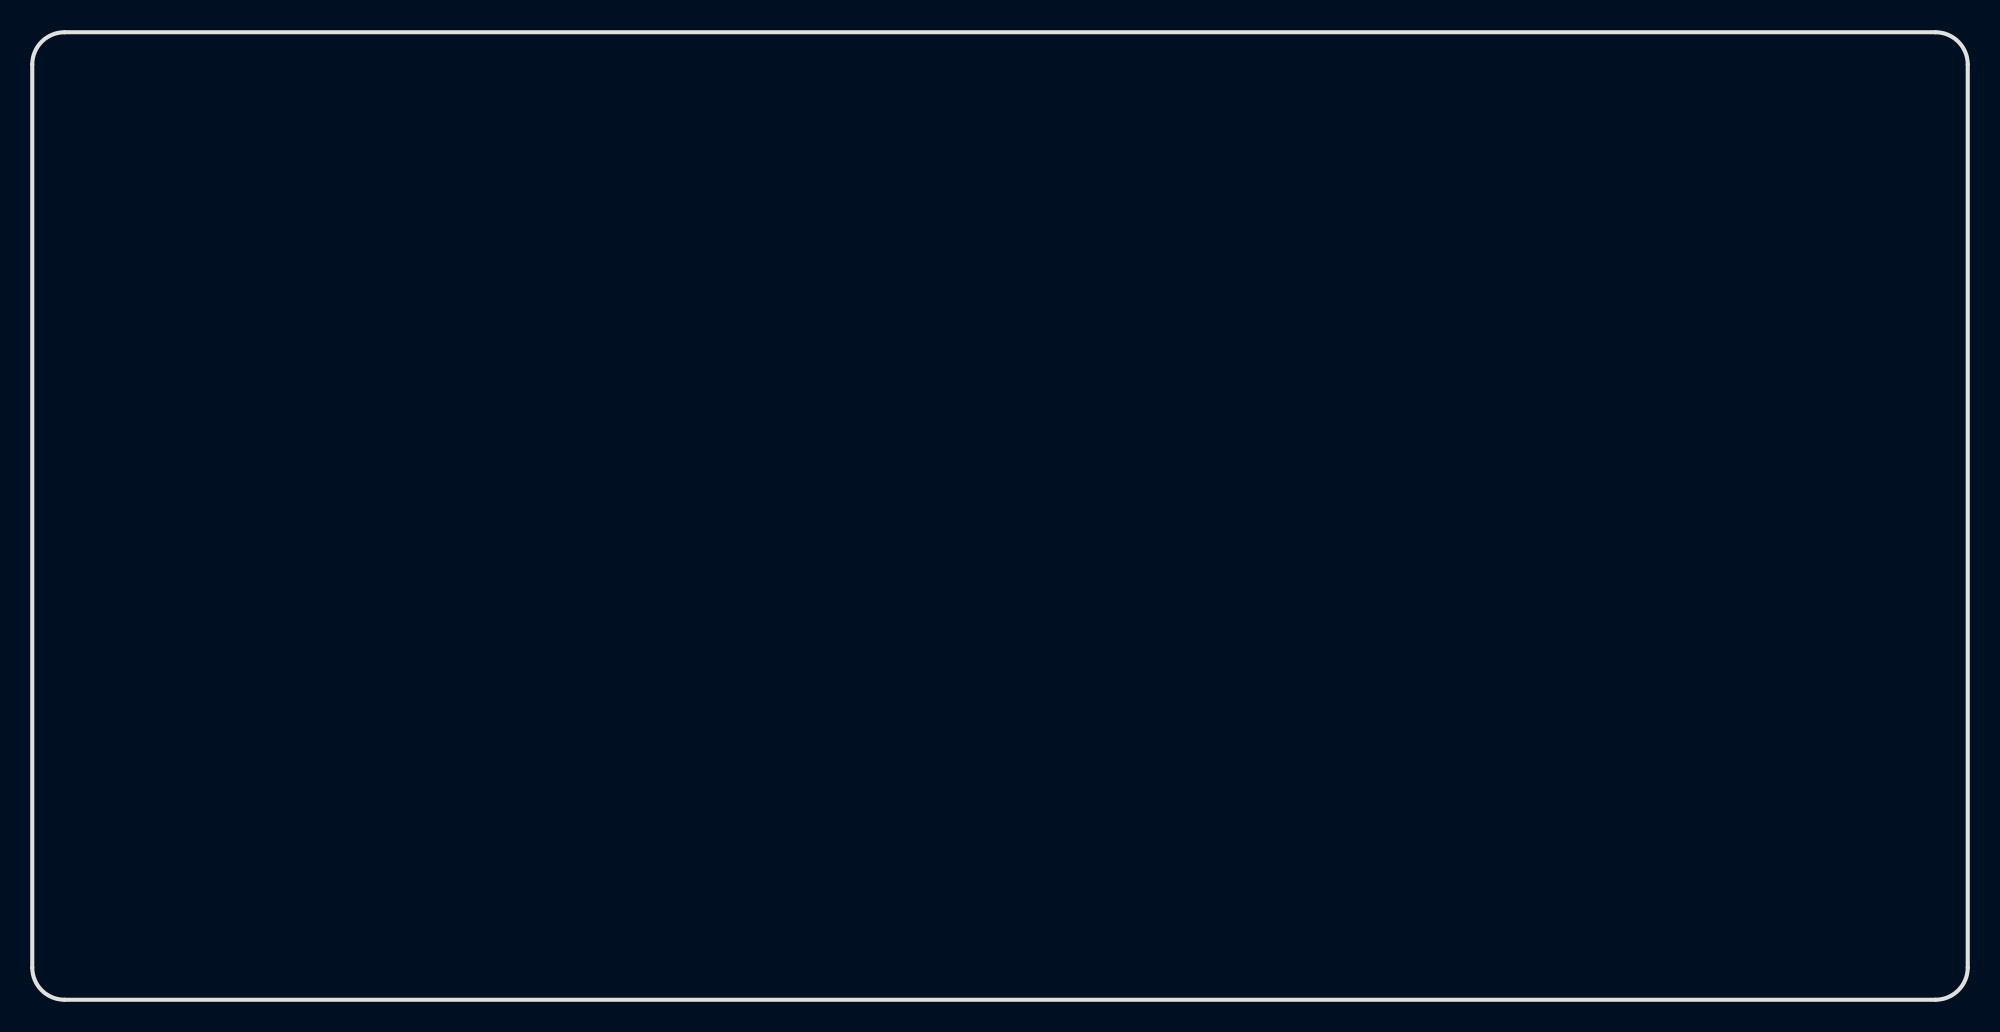
[diagram p5: board, top side]
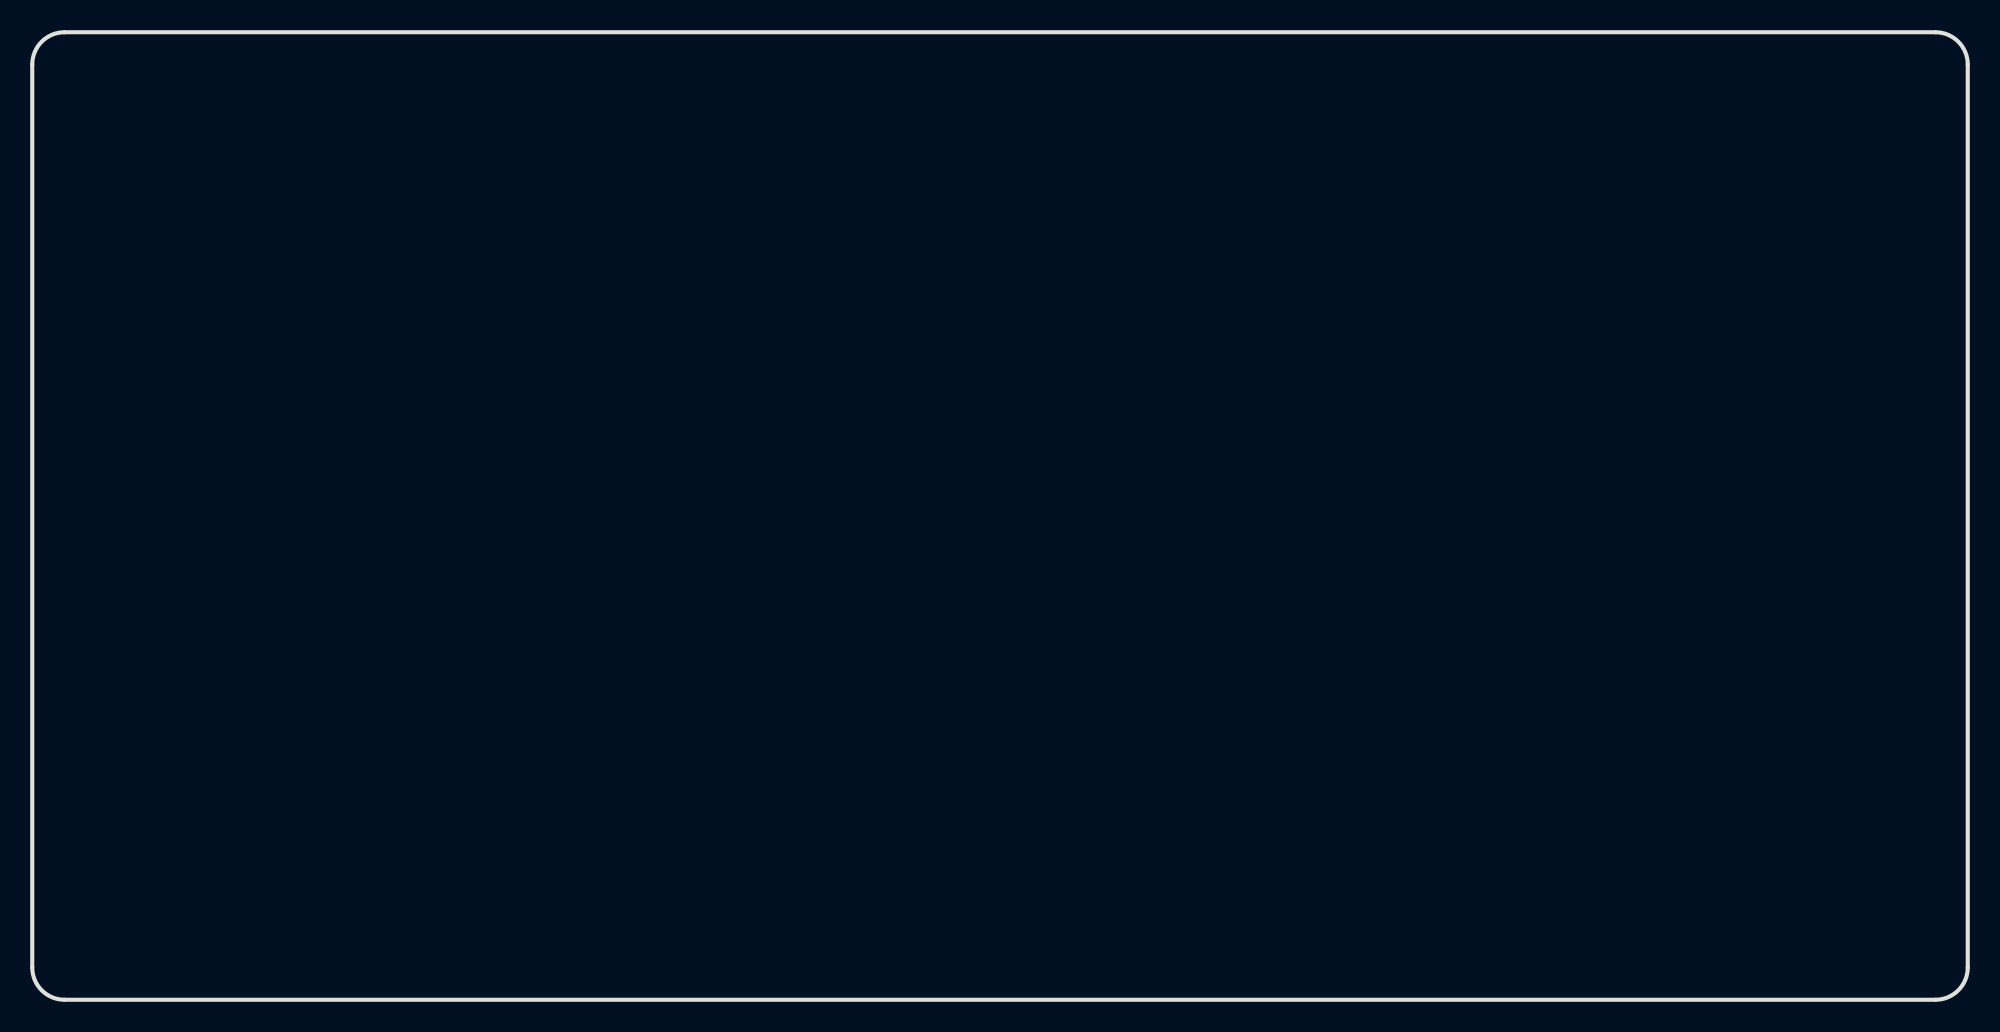
[diagram p6: board, bottom side, seen from below]

Outline 120 x 60 mm; copper layers: Top Layer, Bottom Layer. Coordinates in mm from the lower left corner of the outline.
Outline path: 0,58 0,2 arc(0.59,0.59) 2,0 118,0 arc(119.41,0.59) 120,2 120,58 arc(119.41,59.41) 118,60 2,60 arc(0.59,59.41) 0,58
Stack: Top Layer 0.035mm / Dielectric1 1.51mm FR4 er 4.5 / Bottom Layer 0.035mm

## Design rules (mm)
template: 自定义配置
spacing copperThickness1oz (default): track to track 0.102, other pairs 0.152 to 0.3
track width copperThickness1oz (default): min 0.127, default 0.254, max 2.54
differential pair differentialPair (default): width min 0.127, default 0.254, max 2.54; gap min 0.152, default 0.152
via viaSize (default): diameter min 0.5, default 0.61, max 10; hole min 0.3, default 0.305, max 6.3

## Placement (name value [footprint] x y rotation side)

## Nets
As in the schematic.

## Text on the board
Document Layer: A1
